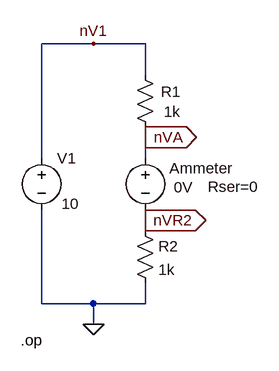
[diagram p0: schematic ammeter_as_0V.asc]
ammeter_as_0V.asc, the LTspice schematic file:
Version 4
SHEET 1 936 680
WIRE 80 -224 0 -224
WIRE 160 -224 80 -224
WIRE 160 -176 160 -224
WIRE 160 -80 160 -96
WIRE 0 -48 0 -224
WIRE 160 -48 160 -80
WIRE 160 48 160 32
WIRE 160 64 160 48
WIRE 0 176 0 32
WIRE 80 176 0 176
WIRE 160 176 160 144
WIRE 160 176 80 176
WIRE 80 208 80 176
FLAG 80 208 0
FLAG 80 -224 nV1
FLAG 160 -80 nVA
IOPIN 160 -80 Out
FLAG 160 48 nVR2
IOPIN 160 48 Out
SYMBOL voltage 0 -64 R0
WINDOW 3 31 86 Left 2
WINDOW 123 0 0 Left 0
WINDOW 39 0 0 Left 0
SYMATTR Value 10
SYMATTR InstName V1
SYMBOL res 144 -192 R0
WINDOW 0 40 42 Left 2
WINDOW 3 45 73 Left 2
SYMATTR InstName R1
SYMATTR Value 1k
SYMBOL res 144 48 R0
SYMATTR InstName R2
SYMATTR Value 1k
SYMBOL voltage 160 -64 R0
WINDOW 123 0 0 Left 0
WINDOW 39 96 60 Left 2
WINDOW 0 37 32 Left 2
WINDOW 3 44 61 Left 2
SYMATTR SpiceLine Rser=0
SYMATTR InstName Ammeter
SYMATTR Value 0V
TEXT -32 232 Left 2 !.op

The netlist it stands for:
* ammeter_as_0V.asc
V1 nV1 0 10
R1 nV1 nVA 1k
R2 nVR2 0 1k
V§Ammeter nVA nVR2 0V Rser=0
.op
.backanno
.end